# Altium schematic sheet PI_DI_Input.SchDoc: PI_DI_Input
size A4; Author: GAOYANG; Organization: Altium Limited; Address1: L3, 12a Rodborough Rd; Address2: Frenchs Forest; Address3: NSW; Address4: Australia 2086
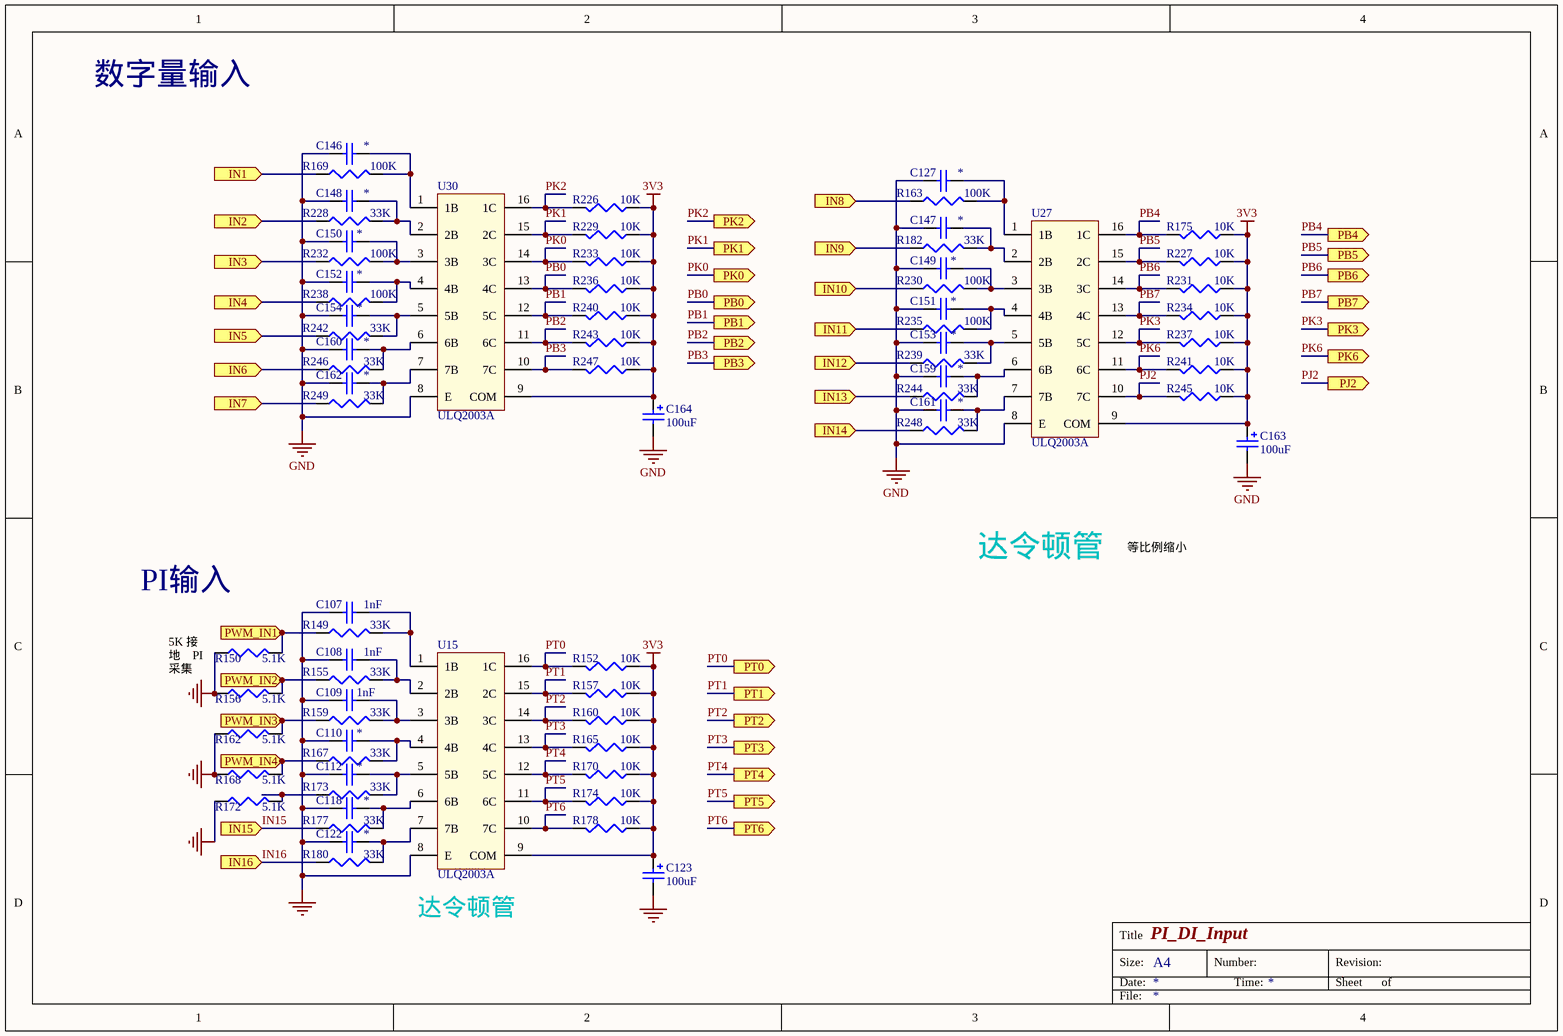
[diagram p0: PI_DI_Input.SchDoc]

## Parts
C107  value 1nF  [0603-L]  (hidden comment: Cap)
C108  value 1nF  [0603-L]  (hidden comment: Cap)
C109  value 1nF  [0603-L]  (hidden comment: Cap)
C110  Cap  [0603-L]  (value not drawn)
C112  Cap  [0603-L]  (value not drawn)
C118  Cap  [0603-L]  (value not drawn)
C122  Cap  [0603-L]  (value not drawn)
C123  value 100uF  [CAP1+]  (hidden comment: Cap Pol2)
C127  Cap  [0603-L]  (value not drawn)
C146  Cap  [0603-L]  (value not drawn)
C147  Cap  [0603-L]  (value not drawn)
C148  Cap  [0603-L]  (value not drawn)
C149  Cap  [0603-L]  (value not drawn)
C150  Cap  [0603-L]  (value not drawn)
C151  Cap  [0603-L]  (value not drawn)
C152  Cap  [0603-L]  (value not drawn)
C153  Cap  [0603-L]  (value not drawn)
C154  Cap  [0603-L]  (value not drawn)
C159  Cap  [0603-L]  (value not drawn)
C160  Cap  [0603-L]  (value not drawn)
C161  Cap  [0603-L]  (value not drawn)
C162  Cap  [0603-L]  (value not drawn)
C163  value 100uF  [CAP1+]  (hidden comment: Cap Pol2)
C164  value 100uF  [CAP1+]  (hidden comment: Cap Pol2)
R149  value 33K  [0603-L]  (hidden comment: Res3)
R150  value 5.1K  [0603-L]  (hidden comment: Res3)
R152  value 10K  [0603-L]  (hidden comment: Res3)
R155  value 33K  [0603-L]  (hidden comment: Res3)
R156  value 5.1K  [0603-L]  (hidden comment: Res3)
R157  value 10K  [0603-L]  (hidden comment: Res3)
R159  value 33K  [0603-L]  (hidden comment: Res3)
R160  value 10K  [0603-L]  (hidden comment: Res3)
R162  value 5.1K  [0603-L]  (hidden comment: Res3)
R163  value 100K  [0603-L]  (hidden comment: Res3)
R165  value 10K  [0603-L]  (hidden comment: Res3)
R167  value 33K  [0603-L]  (hidden comment: Res3)
R168  value 5.1K  [0603-L]  (hidden comment: Res3)
R169  value 100K  [0603-L]  (hidden comment: Res3)
R170  value 10K  [0603-L]  (hidden comment: Res3)
R172  value 5.1K  [0603-L]  (hidden comment: Res3)
R173  value 33K  [0603-L]  (hidden comment: Res3)
R174  value 10K  [0603-L]  (hidden comment: Res3)
R175  value 10K  [0603-L]  (hidden comment: Res3)
R177  value 33K  [0603-L]  (hidden comment: Res3)
R178  value 10K  [0603-L]  (hidden comment: Res3)
R180  value 33K  [0603-L]  (hidden comment: Res3)
R182  value 33K  [0603-L]  (hidden comment: Res3)
R226  value 10K  [0603-L]  (hidden comment: Res3)
R227  value 10K  [0603-L]  (hidden comment: Res3)
R228  value 33K  [0603-L]  (hidden comment: Res3)
R229  value 10K  [0603-L]  (hidden comment: Res3)
R230  value 100K  [0603-L]  (hidden comment: Res3)
R231  value 10K  [0603-L]  (hidden comment: Res3)
R232  value 100K  [0603-L]  (hidden comment: Res3)
R233  value 10K  [0603-L]  (hidden comment: Res3)
R234  value 10K  [0603-L]  (hidden comment: Res3)
R235  value 100K  [0603-L]  (hidden comment: Res3)
R236  value 10K  [0603-L]  (hidden comment: Res3)
R237  value 10K  [0603-L]  (hidden comment: Res3)
R238  value 100K  [0603-L]  (hidden comment: Res3)
R239  value 33K  [0603-L]  (hidden comment: Res3)
R240  value 10K  [0603-L]  (hidden comment: Res3)
R241  value 10K  [0603-L]  (hidden comment: Res3)
R242  value 33K  [0603-L]  (hidden comment: Res3)
R243  value 10K  [0603-L]  (hidden comment: Res3)
R244  value 33K  [0603-L]  (hidden comment: Res3)
R245  value 10K  [0603-L]  (hidden comment: Res3)
R246  value 33K  [0603-L]  (hidden comment: Res3)
R247  value 10K  [0603-L]  (hidden comment: Res3)
R248  value 33K  [0603-L]  (hidden comment: Res3)
R249  value 33K  [0603-L]  (hidden comment: Res3)
U15  ULQ2003A  [HC4851]
U27  ULQ2003A  [HC4851]
U30  ULQ2003A  [HC4851]

## Ports
IN1 (in), IN2 (in), IN3 (in), IN4 (in), IN5 (in), IN6 (in), IN7 (in), IN8 (in), IN9 (in), IN10 (in), IN11 (in), IN12 (in), IN13 (in), IN14 (in), IN15 (in), IN16 (in), PB0 (out), PB1 (out), PB2 (out), PB3 (out), PB4 (out), PB5 (out), PB6 (out), PB7 (out), PJ2 (out), PK0 (out), PK1 (out), PK2 (out), PK3 (out), PK6 (out), PT0 (out), PT1 (out), PT2 (out), PT3 (out), PT4 (out), PT5 (out), PT6 (out), PWM_IN1 (in), PWM_IN2 (in), PWM_IN3 (in), PWM_IN4 (in)

## Nets
3V3: C123.1 C163.1 C164.1 R152.1 R157.1 R160.1 R165.1 R170.1 R174.1 R175.1 R178.1 R226.1 R227.1 R229.1 R231.1 R233.1 R234.1 R236.1 R237.1 R240.1 R241.1 R243.1 R245.1 R247.1 U15.9(COM) U27.9(COM) U30.9(COM)
GND: C107.2 C108.2 C109.2 C110.2 C112.2 C118.2 C122.2 C123.2 C127.2 C146.2 C147.2 C148.2 C149.2 C150.2 C151.2 C152.2 C153.2 C154.2 C159.2 C160.2 C161.2 C162.2 C163.2 C164.2 R150.1 R156.1 R162.1 R168.1 R172.1 U15.8(E) U27.8(E) U30.8(E)
IN1: R169.1 ; port IN1
IN2: R228.1 ; port IN2
IN3: R232.1 ; port IN3
IN4: R238.1 ; port IN4
IN5: R242.1 ; port IN5
IN6: R246.1 ; port IN6
IN7: R249.1 ; port IN7
IN8: R163.1 ; port IN8
IN9: R182.1 ; port IN9
IN10: R230.1 ; port IN10
IN11: R235.1 ; port IN11
IN12: R239.1 ; port IN12
IN13: R244.1 ; port IN13
IN14: R248.1 ; port IN14
IN15: R177.1 ; port IN15
IN16: R180.1 ; port IN16
PB0: R236.2 U30.13(4C) ; port PB0
PB1: R240.2 U30.12(5C) ; port PB1
PB2: R243.2 U30.11(6C) ; port PB2
PB3: R247.2 U30.10(7C) ; port PB3
PB4: R175.2 U27.16(1C) ; port PB4
PB5: R227.2 U27.15(2C) ; port PB5
PB6: R231.2 U27.14(3C) ; port PB6
PB7: R234.2 U27.13(4C) ; port PB7
PJ2: R245.2 U27.10(7C) ; port PJ2
PK0: R233.2 U30.14(3C) ; port PK0
PK1: R229.2 U30.15(2C) ; port PK1
PK2: R226.2 U30.16(1C) ; port PK2
PK3: R237.2 U27.12(5C) ; port PK3
PK6: R241.2 U27.11(6C) ; port PK6
PT0: R152.2 U15.16(1C) ; port PT0
PT1: R157.2 U15.15(2C) ; port PT1
PT2: R160.2 U15.14(3C) ; port PT2
PT3: R165.2 U15.13(4C) ; port PT3
PT4: R170.2 U15.12(5C) ; port PT4
PT5: R174.2 U15.11(6C) ; port PT5
PT6: R178.2 U15.10(7C) ; port PT6
PWM_IN1: R149.1 R150.2 ; port PWM_IN1
PWM_IN2: R155.1 R156.2 ; port PWM_IN2
PWM_IN3: R159.1 R162.2 ; port PWM_IN3
PWM_IN4: R167.1 R168.2 ; port PWM_IN4
NetC107_1: C107.1 R149.2 U15.1(1B)
NetC108_1: C108.1 R155.2 U15.2(2B)
NetC109_1: C109.1 R159.2 U15.3(3B)
NetC110_1: C110.1 R167.2 U15.4(4B)
NetC112_1: C112.1 R173.2 U15.5(5B)
NetC118_1: C118.1 R177.2 U15.6(6B)
NetC122_1: C122.1 R180.2 U15.7(7B)
NetC127_1: C127.1 R163.2 U27.1(1B)
NetC146_1: C146.1 R169.2 U30.1(1B)
NetC147_1: C147.1 R182.2 U27.2(2B)
NetC148_1: C148.1 R228.2 U30.2(2B)
NetC149_1: C149.1 R230.2 U27.3(3B)
NetC150_1: C150.1 R232.2 U30.3(3B)
NetC151_1: C151.1 R235.2 U27.4(4B)
NetC152_1: C152.1 R238.2 U30.4(4B)
NetC153_1: C153.1 R239.2 U27.5(5B)
NetC154_1: C154.1 R242.2 U30.5(5B)
NetC159_1: C159.1 R244.2 U27.6(6B)
NetC160_1: C160.1 R246.2 U30.6(6B)
NetC161_1: C161.1 R248.2 U27.7(7B)
NetC162_1: C162.1 R249.2 U30.7(7B)
NetR172_2: R172.2 R173.1

## Notes on the sheet
- 数字量输入
- 达令顿管
- 等比例缩小
- PI输入
- 5K 接地    PI采集
- Title
- Size:
- Date:
- A4
- Number:
- Time:
- Revision:
- Sheet
- of
- File:

## Library data of the parts
C107-C110 C112 C118 C122 C127 C146-C154 C159-C162 = Cap: Capacitor; Published: 8-Jun-2000; LatestRevisionDate: 17-Jul-2002; LatestRevisionNote: Re-released for DXP Platform.; PackageReference: RAD-0.3; Publisher: Altium Limited; PackageDescription: Radial Cap, Thru-Hole; 2 Leads; 0.3 in Pin Spacing
  C110 C112 C118 C122 C127 C146-C154 C159-C162: Value: *
C123 C163 C164 = Cap Pol2: Polarized Capacitor (Axial); Published: 8-Jun-2000; LatestRevisionDate: 17-Jul-2002; LatestRevisionNote: Re-released for DXP Platform.; PackageReference: POLAR0.8; Publisher: Altium Limited; PackageDescription: Polarized Capacitor; 2 Leads
R149 R150 R152 R155-R157 R159 R160 R162 R163 R165 R167-R170 R172-R175 R177 R178 R180 R182 R226-R249 = Res3: Resistor; Published: 8-Jun-2000; LatestRevisionDate: 29-May-2009; LatestRevisionNote: IPC-7351 Footprint Added.; PackageReference: J1-0603; Publisher: Altium Limited; PackageDescription: Chip Resistor